# EAGLE schematic lightbar_rgb (EAGLE 5.10)
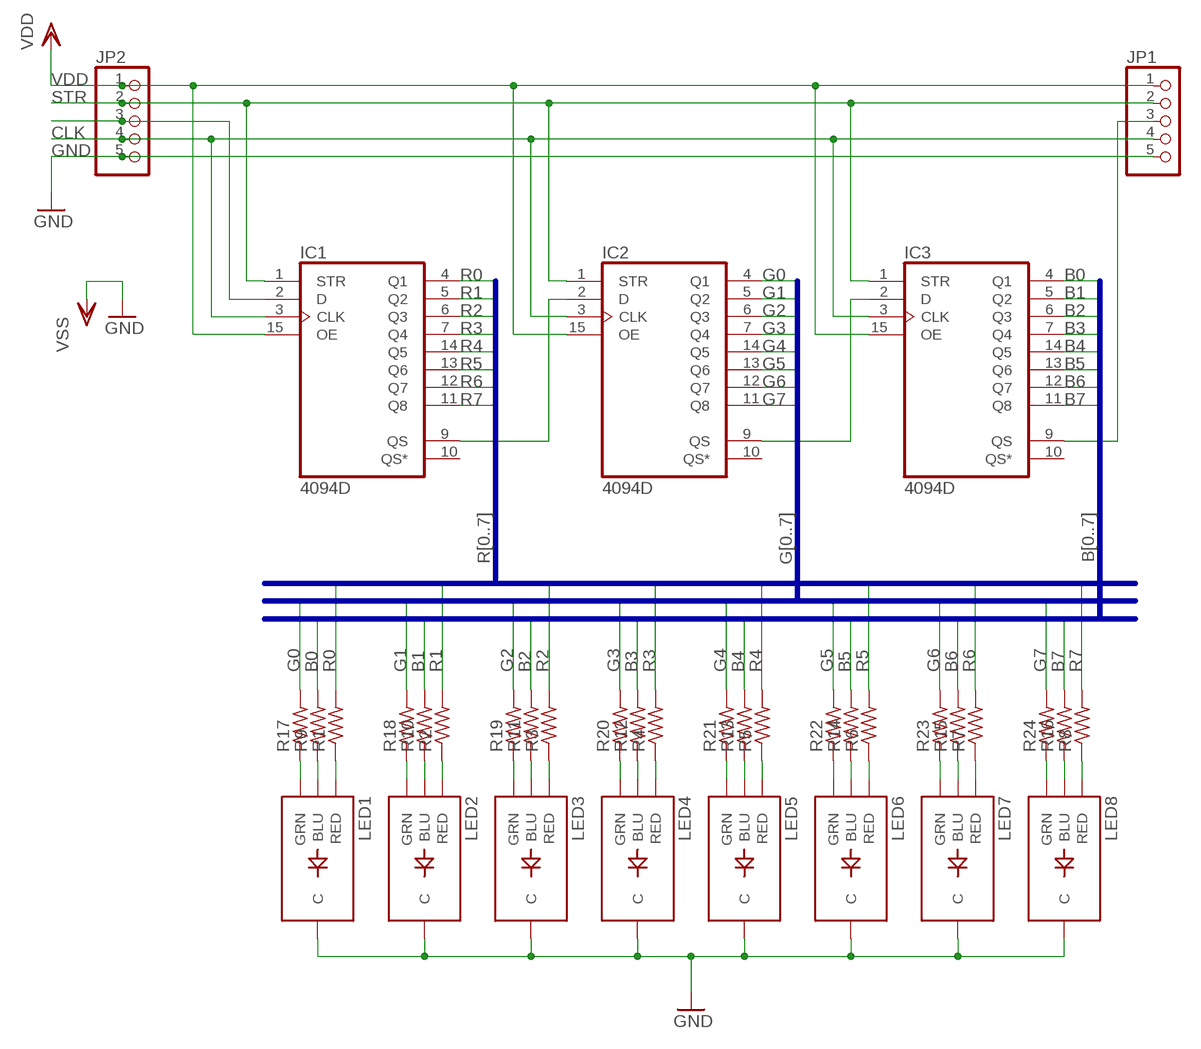
[diagram p0: schematic, sheet 1]

## Parts
IC1  4094D  [SO16]
IC2  4094D  [SO16]
IC3  4094D  [SO16]
JP1  PINHD-1X5/90  [1X05/90]
JP2  PINHD-1X5  [1X05]
LED1  LED-TRICOLOR-THROUGHHOLE  [LED-TRICOLOR-THROUGHHOLE]
LED2  LED-TRICOLOR-THROUGHHOLE  [LED-TRICOLOR-THROUGHHOLE]
LED3  LED-TRICOLOR-THROUGHHOLE  [LED-TRICOLOR-THROUGHHOLE]
LED4  LED-TRICOLOR-THROUGHHOLE  [LED-TRICOLOR-THROUGHHOLE]
LED5  LED-TRICOLOR-THROUGHHOLE  [LED-TRICOLOR-THROUGHHOLE]
LED6  LED-TRICOLOR-THROUGHHOLE  [LED-TRICOLOR-THROUGHHOLE]
LED7  LED-TRICOLOR-THROUGHHOLE  [LED-TRICOLOR-THROUGHHOLE]
LED8  LED-TRICOLOR-THROUGHHOLE  [LED-TRICOLOR-THROUGHHOLE]
R1  R-US_R0805  [R0805]
R2  R-US_R0805  [R0805]
R3  R-US_R0805  [R0805]
R4  R-US_R0805  [R0805]
R5  R-US_R0805  [R0805]
R6  R-US_R0805  [R0805]
R7  R-US_R0805  [R0805]
R8  R-US_R0805  [R0805]
R9  R-US_R0805  [R0805]
R10  R-US_R0805  [R0805]
R11  R-US_R0805  [R0805]
R12  R-US_R0805  [R0805]
R13  R-US_R0805  [R0805]
R14  R-US_R0805  [R0805]
R15  R-US_R0805  [R0805]
R16  R-US_R0805  [R0805]
R17  R-US_R0805  [R0805]
R18  R-US_R0805  [R0805]
R19  R-US_R0805  [R0805]
R20  R-US_R0805  [R0805]
R21  R-US_R0805  [R0805]
R22  R-US_R0805  [R0805]
R23  R-US_R0805  [R0805]
R24  R-US_R0805  [R0805]

## Nets
B0: IC3.4(Q1) R9.2
B1: IC3.5(Q2) R10.2
B2: IC3.6(Q3) R11.2
B3: IC3.7(Q4) R12.2
B4: IC3.14(Q5) R13.2
B5: IC3.13(Q6) R14.2
B6: IC3.12(Q7) R15.2
B7: IC3.11(Q8) R16.2
CLK: IC1.3(CLK) IC2.3(CLK) IC3.3(CLK) JP1.4 JP2.4
G0: IC2.4(Q1) R17.2
G1: IC2.5(Q2) R18.2
G2: IC2.6(Q3) R19.2
G3: IC2.7(Q4) R20.2
G4: IC2.14(Q5) R21.2
G5: IC2.13(Q6) R22.2
G6: IC2.12(Q7) R23.2
G7: IC2.11(Q8) R24.2
GND: JP1.5 JP2.5 LED1.GND(C) LED2.GND(C) LED3.GND(C) LED4.GND(C) LED5.GND(C) LED6.GND(C) LED7.GND(C) LED8.GND(C) ; supply symbol labelled VSS
N$2: IC1.9(QS) IC2.2(D)
N$3: IC2.9(QS) IC3.2(D)
N$4: IC3.9(QS) JP1.3
N$5: IC1.2(D) JP2.3
N$6: LED1.RED R1.1
N$7: LED2.RED R2.1
N$8: LED3.RED R3.1
N$9: LED4.RED R4.1
N$10: LED5.RED R5.1
N$11: LED6.RED R6.1
N$12: LED7.RED R7.1
N$13: LED8.RED R8.1
N$14: LED1.BLU R9.1
N$15: LED2.BLU R10.1
N$16: LED3.BLU R11.1
N$17: LED4.BLU R12.1
N$18: LED5.BLU R13.1
N$19: LED6.BLU R14.1
N$20: LED7.BLU R15.1
N$21: LED8.BLU R16.1
N$22: LED1.GRN R17.1
N$23: LED2.GRN R18.1
N$24: LED3.GRN R19.1
N$25: LED4.GRN R20.1
N$26: LED5.GRN R21.1
N$27: LED6.GRN R22.1
N$28: LED7.GRN R23.1
N$29: LED8.GRN R24.1
R0: IC1.4(Q1) R1.2
R1: IC1.5(Q2) R2.2
R2: IC1.6(Q3) R3.2
R3: IC1.7(Q4) R4.2
R4: IC1.14(Q5) R5.2
R5: IC1.13(Q6) R6.2
R6: IC1.12(Q7) R7.2
R7: IC1.11(Q8) R8.2
STR: IC1.1(STR) IC2.1(STR) IC3.1(STR) JP1.2 JP2.2
VDD: IC1.15(OE) IC2.15(OE) IC3.15(OE) JP1.1 JP2.1
Unconnected: IC1.10(QS*) IC2.10(QS*) IC3.10(QS*)

## Buses
R[0..7]
G[0..7]
B[0..7]

## Power pins joined to a net without a drawn wire
GND: IC1.8(VSS) IC2.8(VSS) IC3.8(VSS)
VDD: IC1.16(VDD) IC2.16(VDD) IC3.16(VDD)

## Library data of the parts
IC1-IC3 = 40xx:4094: 8-stage SHIFT/STORE REGISTER, tri-state
JP1 JP2 = pinhead:PINHD-1X5: PIN HEADER
LED1-LED8 = SparkFun:LED-TRICOLOR-THROUGHHOLE
R1-R24 = resistor:R-US_: RESISTOR, American symbol